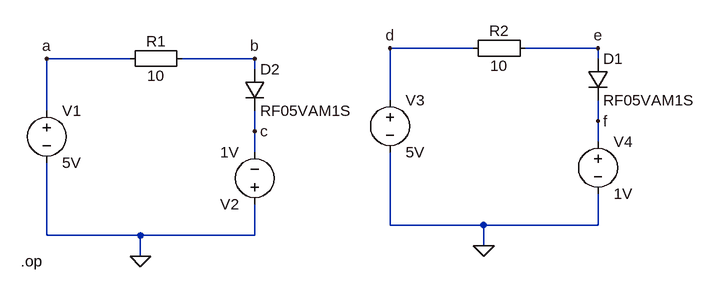
[diagram p0: schematic Diode-Clipper-OP.asc]
Diode-Clipper-OP.asc, the LTspice schematic file:
Version 4
SHEET 1 908 680
WIRE 560 128 432 128
WIRE 752 128 640 128
WIRE 32 144 -96 144
WIRE 224 144 112 144
WIRE 752 144 752 128
WIRE 224 160 224 144
WIRE 432 208 432 128
WIRE -96 224 -96 144
WIRE 752 240 752 208
WIRE 224 256 224 224
WIRE 752 272 752 240
WIRE 224 288 224 256
WIRE 432 400 432 288
WIRE 576 400 432 400
WIRE 752 400 752 352
WIRE 752 400 576 400
WIRE -96 416 -96 304
WIRE 48 416 -96 416
WIRE 224 416 224 368
WIRE 224 416 48 416
WIRE 576 432 576 400
WIRE 48 448 48 416
FLAG -96 144 a
FLAG 224 144 b
FLAG 48 448 0
FLAG 224 256 c
FLAG 432 128 d
FLAG 752 128 e
FLAG 576 432 0
FLAG 752 240 f
SYMBOL diode 208 160 R0
SYMATTR InstName D2
SYMATTR Value RF05VAM1S
SYMBOL Misc\\EuropeanResistor 128 128 R90
WINDOW 0 5 56 VBottom 2
WINDOW 3 27 56 VTop 2
SYMATTR InstName R1
SYMATTR Value 10
SYMBOL voltage -96 208 R0
WINDOW 123 0 0 Left 0
WINDOW 39 0 0 Left 0
SYMATTR InstName V1
SYMATTR Value 5V
SYMBOL voltage 224 384 R180
WINDOW 123 0 0 Left 0
WINDOW 39 0 0 Left 0
SYMATTR InstName V2
SYMATTR Value 1V
SYMBOL diode 736 144 R0
SYMATTR InstName D1
SYMATTR Value RF05VAM1S
SYMBOL Misc\\EuropeanResistor 656 112 R90
WINDOW 0 5 56 VBottom 2
WINDOW 3 27 56 VTop 2
SYMATTR InstName R2
SYMATTR Value 10
SYMBOL voltage 432 192 R0
WINDOW 123 0 0 Left 0
WINDOW 39 0 0 Left 0
SYMATTR InstName V3
SYMATTR Value 5V
SYMBOL voltage 752 256 R0
WINDOW 123 0 0 Left 0
WINDOW 39 0 0 Left 0
SYMATTR InstName V4
SYMATTR Value 1V
TEXT -136 456 Left 2 !.op

The netlist it stands for:
* Diode-Clipper-OP.asc
D2 b c RF05VAM1S
R1 b a 10
V1 a 0 5V
V2 0 c 1V
D1 e f RF05VAM1S
R2 e d 10
V3 d 0 5V
V4 f 0 1V
.model D D
.lib standard.dio
.op
.backanno
.end